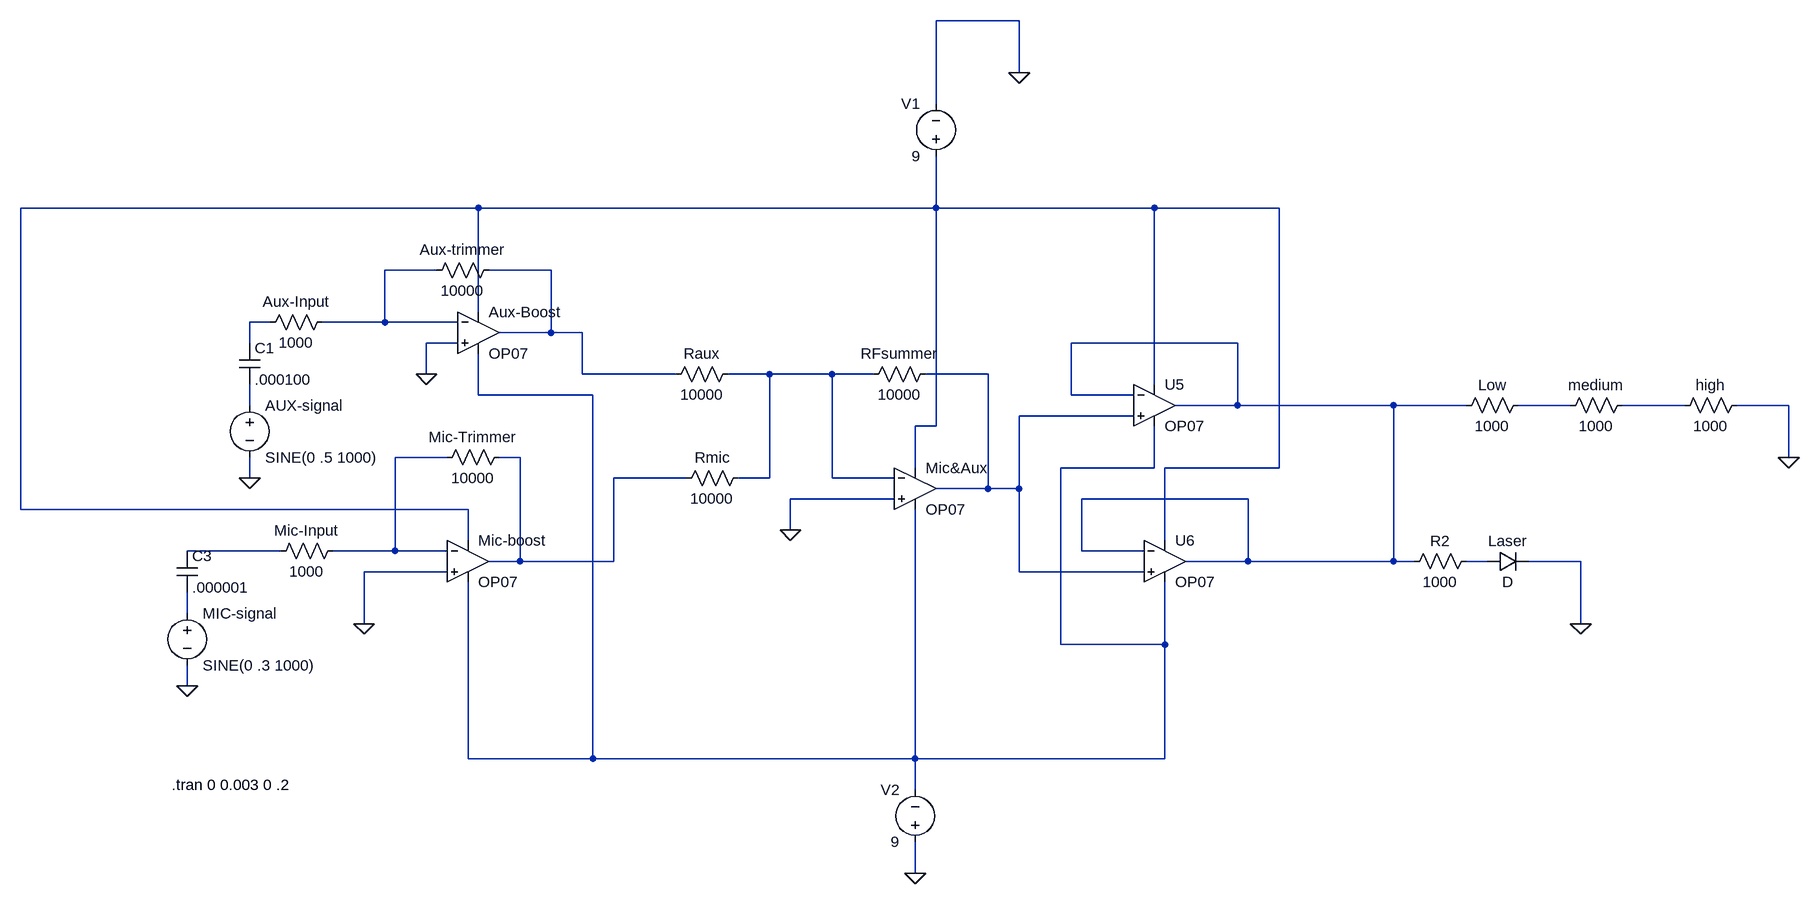
[diagram p0: schematic Laser transmitter.asc]
Laser transmitter.asc, the LTspice schematic file:
Version 4
SHEET 1 1380 788
WIRE 176 -544 48 -544
WIRE 176 -464 176 -544
WIRE 48 -416 48 -544
WIRE -656 -256 -1360 -256
WIRE 48 -256 48 -336
WIRE 48 -256 -656 -256
WIRE 384 -256 48 -256
WIRE 576 -256 384 -256
WIRE -720 -160 -800 -160
WIRE -544 -160 -640 -160
WIRE -656 -96 -656 -256
WIRE -976 -80 -1008 -80
WIRE -800 -80 -800 -160
WIRE -800 -80 -896 -80
WIRE -688 -80 -800 -80
WIRE -544 -64 -544 -160
WIRE -544 -64 -624 -64
WIRE -496 -64 -544 -64
WIRE -1008 -48 -1008 -80
WIRE -688 -48 -736 -48
WIRE 512 -48 256 -48
WIRE -736 0 -736 -48
WIRE -496 0 -496 -64
WIRE -352 0 -496 0
WIRE -208 0 -272 0
WIRE -112 0 -208 0
WIRE -48 0 -112 0
WIRE 128 0 32 0
WIRE 384 16 384 -256
WIRE -656 32 -656 -32
WIRE -480 32 -656 32
WIRE 256 32 256 -48
WIRE 352 32 256 32
WIRE -1008 48 -1008 16
WIRE 512 48 512 -48
WIRE 512 48 416 48
WIRE 752 48 512 48
WIRE 864 48 752 48
WIRE 1024 48 944 48
WIRE 1200 48 1104 48
WIRE 1360 48 1280 48
WIRE 352 64 176 64
WIRE 48 80 48 -256
WIRE 48 80 16 80
WIRE -704 128 -784 128
WIRE -592 128 -624 128
WIRE 1360 128 1360 48
WIRE 16 144 16 80
WIRE 384 144 384 80
WIRE 384 144 240 144
WIRE 576 144 576 -256
WIRE 576 144 400 144
WIRE -1008 160 -1008 128
WIRE -336 160 -448 160
WIRE -208 160 -208 0
WIRE -208 160 -256 160
WIRE -112 160 -112 0
WIRE -16 160 -112 160
WIRE 128 176 128 0
WIRE 128 176 48 176
WIRE 176 176 176 64
WIRE 176 176 128 176
WIRE -16 192 -176 192
WIRE 528 192 272 192
WIRE -1360 208 -1360 -256
WIRE -672 208 -1360 208
WIRE -176 240 -176 192
WIRE -672 256 -672 208
WIRE 400 256 400 144
WIRE -960 272 -1104 272
WIRE -784 272 -784 128
WIRE -784 272 -880 272
WIRE -704 272 -784 272
WIRE 272 272 272 192
WIRE 368 272 272 272
WIRE -592 288 -592 128
WIRE -592 288 -640 288
WIRE -448 288 -448 160
WIRE -448 288 -592 288
WIRE 528 288 528 192
WIRE 528 288 432 288
WIRE 752 288 752 48
WIRE 752 288 528 288
WIRE 784 288 752 288
WIRE 896 288 864 288
WIRE 1040 288 960 288
WIRE -704 304 -832 304
WIRE 176 304 176 176
WIRE 368 304 176 304
WIRE -1104 368 -1104 336
WIRE -832 384 -832 304
WIRE 1040 384 1040 288
WIRE 240 416 240 144
WIRE 400 416 400 320
WIRE 400 416 240 416
WIRE -1104 480 -1104 448
WIRE -672 592 -672 320
WIRE -480 592 -480 32
WIRE -480 592 -672 592
WIRE 16 592 16 208
WIRE 16 592 -480 592
WIRE 400 592 400 416
WIRE 400 592 16 592
WIRE 16 640 16 592
WIRE 16 768 16 720
FLAG 176 -464 0
FLAG -1104 480 0
FLAG -176 240 0
FLAG 1040 384 0
FLAG -832 384 0
FLAG -736 0 0
FLAG -1008 160 0
FLAG 16 768 0
FLAG 1360 128 0
SYMBOL Opamps\\OP07 16 112 R0
SYMATTR InstName Mic&Aux
SYMBOL Opamps\\OP07 384 -16 R0
SYMATTR InstName U5
SYMBOL Opamps\\OP07 400 224 R0
SYMATTR InstName U6
SYMBOL voltage 48 -320 R180
WINDOW 0 24 96 Left 2
WINDOW 3 24 16 Left 2
SYMATTR InstName V1
SYMATTR Value 9
SYMBOL res 48 -16 R90
WINDOW 0 0 56 VBottom 2
WINDOW 3 32 56 VTop 2
SYMATTR InstName RFsummer
SYMATTR Value 10000
SYMBOL diode 896 304 R270
WINDOW 0 32 32 VTop 2
WINDOW 3 0 32 VBottom 2
SYMATTR InstName Laser
SYMBOL res -256 -16 R90
WINDOW 0 0 56 VBottom 2
WINDOW 3 32 56 VTop 2
SYMATTR InstName Raux
SYMATTR Value 10000
SYMBOL Opamps\\OP07 -672 224 R0
SYMATTR InstName Mic-boost
SYMBOL res -608 112 R90
WINDOW 0 0 56 VBottom 2
WINDOW 3 32 56 VTop 2
SYMATTR InstName Mic-Trimmer
SYMATTR Value 10000
SYMBOL res -864 256 R90
WINDOW 0 0 56 VBottom 2
WINDOW 3 32 56 VTop 2
SYMATTR InstName Mic-Input
SYMATTR Value 1000
SYMBOL voltage -1104 352 R0
WINDOW 123 0 0 Left 0
WINDOW 39 0 0 Left 0
SYMATTR InstName MIC-signal
SYMATTR Value SINE(0 .3 1000)
SYMBOL Opamps\\OP07 -656 -128 R0
SYMATTR InstName Aux-Boost
SYMBOL res -624 -176 R90
WINDOW 0 0 56 VBottom 2
WINDOW 3 32 56 VTop 2
SYMATTR InstName Aux-trimmer
SYMATTR Value 10000
SYMBOL res -880 -96 R90
WINDOW 0 0 56 VBottom 2
WINDOW 3 32 56 VTop 2
SYMATTR InstName Aux-Input
SYMATTR Value 1000
SYMBOL voltage -1008 32 R0
WINDOW 123 0 0 Left 0
WINDOW 39 0 0 Left 0
SYMATTR InstName AUX-signal
SYMATTR Value SINE(0 .5 1000)
SYMBOL cap -1120 272 R0
SYMATTR InstName C3
SYMATTR Value .000001
SYMBOL cap -1024 -48 R0
SYMATTR InstName C1
SYMATTR Value .000100
SYMBOL res 880 272 R90
WINDOW 0 0 56 VBottom 2
WINDOW 3 32 56 VTop 2
SYMATTR InstName R2
SYMATTR Value 1000
SYMBOL res -240 144 R90
WINDOW 0 0 56 VBottom 2
WINDOW 3 32 56 VTop 2
SYMATTR InstName Rmic
SYMATTR Value 10000
SYMBOL voltage 16 736 R180
WINDOW 0 24 96 Left 2
WINDOW 3 24 16 Left 2
SYMATTR InstName V2
SYMATTR Value 9
SYMBOL res 960 32 R90
WINDOW 0 0 56 VBottom 2
WINDOW 3 32 56 VTop 2
SYMATTR InstName Low
SYMATTR Value 1000
SYMBOL res 1120 32 R90
WINDOW 0 0 56 VBottom 2
WINDOW 3 32 56 VTop 2
SYMATTR InstName medium
SYMATTR Value 1000
SYMBOL res 1296 32 R90
WINDOW 0 0 56 VBottom 2
WINDOW 3 32 56 VTop 2
SYMATTR InstName high
SYMATTR Value 1000
TEXT -1128 632 Left 2 !.tran 0 0.003 0 .2

The netlist it stands for:
* Laser transmitter.asc
XMic&Aux 0 N006 N001 N008 N007 LT1001  ; OP07, pins In+ In- V+ V- OUT
XU5 N007 N005 N001 N008 N005 LT1001  ; OP07, pins In+ In- V+ V- OUT
XU6 N007 N005 N001 N008 N005 LT1001  ; OP07, pins In+ In- V+ V- OUT
V1 N001 0 9
RFsummer N007 N006 10000
D§Laser N015 0 D
Raux N006 N003 10000
XMic-boost 0 N012 N001 N008 N013 LT1001  ; OP07, pins In+ In- V+ V- OUT
R§Mic-Trimmer N013 N012 10000
R§Mic-Input N012 N014 1000
V§MIC-signal N016 0 SINE(0 .3 1000)
XAux-Boost 0 N002 N001 N008 N003 LT1001  ; OP07, pins In+ In- V+ V- OUT
R§Aux-trimmer N003 N002 10000
R§Aux-Input N002 N004 1000
V§AUX-signal N009 0 SINE(0 .5 1000)
C3 N014 N016 .000001
C1 N004 N009 .000100
R2 N015 N005 1000
Rmic N006 N013 10000
V2 0 N008 9
R§Low N010 N005 1000
R§medium N011 N010 1000
R§high 0 N011 1000
.model D D
.lib standard.dio
.tran 0 0.003 0 .2
.lib LTC.lib
.backanno
.end